# EAGLE schematic zdroje (EAGLE 7.2.0)
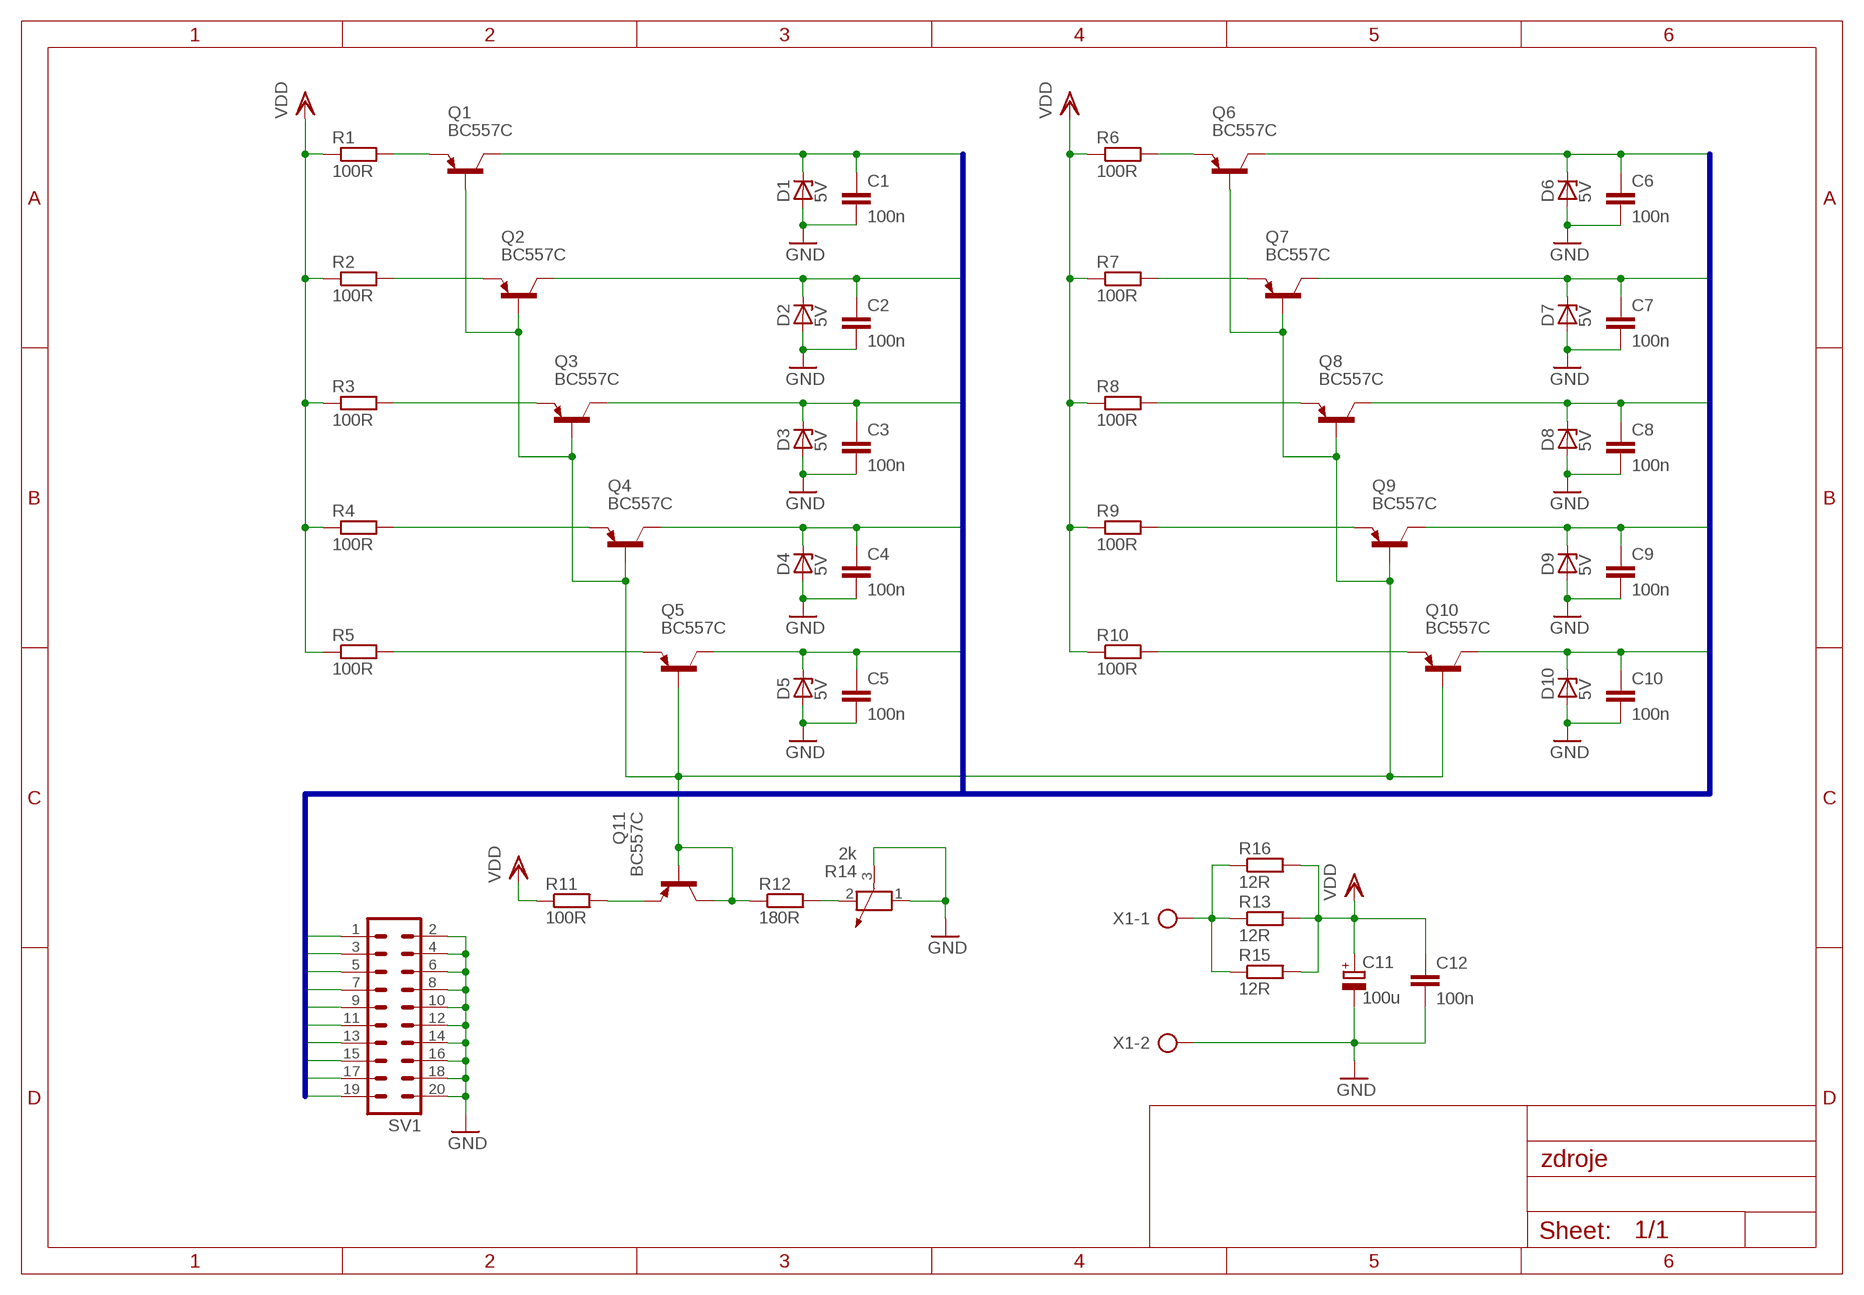
[diagram p0: schematic, sheet 1]

## Parts
C1  100n  C-EU050-030X075  [C050-030X075]
C2  100n  C-EU050-030X075  [C050-030X075]
C3  100n  C-EU050-030X075  [C050-030X075]
C4  100n  C-EU050-030X075  [C050-030X075]
C5  100n  C-EU050-030X075  [C050-030X075]
C6  100n  C-EU050-030X075  [C050-030X075]
C7  100n  C-EU050-030X075  [C050-030X075]
C8  100n  C-EU050-030X075  [C050-030X075]
C9  100n  C-EU050-030X075  [C050-030X075]
C10  100n  C-EU050-030X075  [C050-030X075]
C11  100u  CPOL-EUE5-8.5  [E5-8,5]
C12  100n  C-EU050-030X075  [C050-030X075]
D1  5V  ZENER-DIODEDO35Z10  [DO35Z10]
D2  5V  ZENER-DIODEDO35Z10  [DO35Z10]
D3  5V  ZENER-DIODEDO35Z10  [DO35Z10]
D4  5V  ZENER-DIODEDO35Z10  [DO35Z10]
D5  5V  ZENER-DIODEDO35Z10  [DO35Z10]
D6  5V  ZENER-DIODEDO35Z10  [DO35Z10]
D7  5V  ZENER-DIODEDO35Z10  [DO35Z10]
D8  5V  ZENER-DIODEDO35Z10  [DO35Z10]
D9  5V  ZENER-DIODEDO35Z10  [DO35Z10]
D10  5V  ZENER-DIODEDO35Z10  [DO35Z10]
Q1  BC557C  [TO92-EBC]
Q2  BC557C  [TO92-EBC]
Q3  BC557C  [TO92-EBC]
Q4  BC557C  [TO92-EBC]
Q5  BC557C  [TO92-EBC]
Q6  BC557C  [TO92-EBC]
Q7  BC557C  [TO92-EBC]
Q8  BC557C  [TO92-EBC]
Q9  BC557C  [TO92-EBC]
Q10  BC557C  [TO92-EBC]
Q11  BC557C  [TO92-EBC]
R1  100R  R-EU_0207/10  [0207/10]
R2  100R  R-EU_0207/10  [0207/10]
R3  100R  R-EU_0207/10  [0207/10]
R4  100R  R-EU_0207/10  [0207/10]
R5  100R  R-EU_0207/10  [0207/10]
R6  100R  R-EU_0207/10  [0207/10]
R7  100R  R-EU_0207/10  [0207/10]
R8  100R  R-EU_0207/10  [0207/10]
R9  100R  R-EU_0207/10  [0207/10]
R10  100R  R-EU_0207/10  [0207/10]
R11  100R  R-EU_0207/10  [0207/10]
R12  180R  R-EU_0207/10  [0207/10]
R13  12R  R-EU_0207/10  [0207/10]
R14  2k  POTENTIOMETER_PT_SPIN  [PT-SPIN]
R15  12R  R-EU_0207/10  [0207/10]
R16  12R  R-EU_0207/10  [0207/10]
SV1  MA10-2  [MA10-2]
X1  AK300/2  [AK300/2]

## Nets
GND: C1.2 C2.2 C3.2 C4.2 C5.2 C6.2 C7.2 C8.2 C9.2 C10.2 C11.- C12.2 D1.A D2.A D3.A D4.A D5.A D6.A D7.A D8.A D9.A D10.A R14.1 R14.3 SV1.2 SV1.4 SV1.6 SV1.8 SV1.10 SV1.12 SV1.14 SV1.16 SV1.18 SV1.20 X1.2
I1: C1.1 D1.C Q1.C SV1.1
I2: C2.1 D2.C Q2.C SV1.3
I3: C3.1 D3.C Q3.C SV1.5
I4: C4.1 D4.C Q4.C SV1.7
I5: C5.1 D5.C Q5.C SV1.9
I6: C6.1 D6.C Q6.C SV1.11
I7: C7.1 D7.C Q7.C SV1.13
I8: C8.1 D8.C Q8.C SV1.15
I9: C9.1 D9.C Q9.C SV1.17
I10: C10.1 D10.C Q10.C SV1.19
N$1: Q1.E R1.2
N$2: Q2.E R2.2
N$3: Q3.E R3.2
N$4: Q4.E R4.2
N$5: Q5.E R5.2
N$6: Q6.E R6.2
N$7: Q7.E R7.2
N$8: Q8.E R8.2
N$9: Q9.E R9.2
N$10: Q10.E R10.2
N$11: R12.2 R14.2
N$12: Q1.B Q2.B Q3.B Q4.B Q5.B Q6.B Q7.B Q8.B Q9.B Q10.B Q11.B Q11.C R12.1
N$13: Q11.E R11.2
N$14: R13.1 R15.1 R16.1 X1.1
VDD: C11.+ C12.1 R1.1 R2.1 R3.1 R4.1 R5.1 R6.1 R7.1 R8.1 R9.1 R10.1 R11.1 R13.2 R15.2 R16.2

## Buses
I[1..10]

## Library data of the parts
C1-C10 C12 = rcl:C-EU: CAPACITOR, European symbol
C11 = rcl:CPOL-EU: POLARIZED CAPACITOR, European symbol
D1-D10 = diode:ZENER-DIODE: Z-Diode
Q1-Q11 = transistor-pnp:BC557*: PNP Transistror
R1-R13 R15 R16 = rcl:R-EU_: RESISTOR, European symbol
R14 = rcl:POTENTIOMETER_: Potentiometer
SV1 = con-lstb:MA10-2: PIN HEADER; OC_FARNELL: unknown; OC_NEWARK: unknown
X1 = con-ptr500:AK300/2: CONNECTOR; OC_FARNELL: unknown; OC_NEWARK: unknown